# Altium schematic sheet Power.SchDoc
size A4
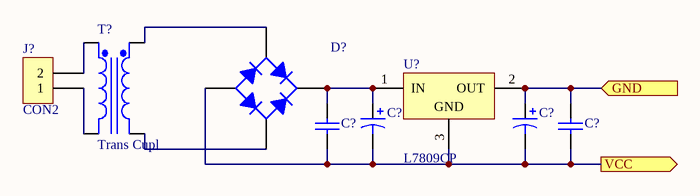
[diagram p0: Power.SchDoc]

## Parts
(Parts that share a designator on the sheet are numbered #1, #2 ... from top to bottom, then left to right.)
C?#1  Cap Pol2  [POLAR0.8]  (value not drawn)
C?#2  Cap Pol2  [POLAR0.8]  (value not drawn)
C?#3  Cap  [RAD-0.3]  (value not drawn)
C?#4  Cap  [RAD-0.3]  (value not drawn)
D?  Bridge1  [D-38]  (value not drawn)
J?  CON2  [PART]
T?  Trans Cupl  [TRF_4]
U?  L7809CP  [ISOWATT220AB]

## Ports
GND, VCC

## Nets
GND: C?#2.1 C?#4.2 U?.2(OUT) ; port GND
VCC: C?#1.2 C?#2.2 C?#3.1 C?#4.1 D?.1(A) U?.3(GND) ; port VCC
NetC?#1_1: C?#1.1 C?#3.2 D?.3(K) U?.1(IN)
NetD?_2: D?.2(C) T?.3(Sec+)
NetD?_4: D?.4(C) T?.4(Sec-)
NetJ?_1: J?.1 T?.2(Pri-)
NetJ?_2: J?.2 T?.1(Pri+)

## Library data of the parts
C?#1 C?#2 = Cap Pol2: Polarized Capacitor (Axial); Value: 100pF; Published: 8-Jun-2000; LatestRevisionDate: 17-Jul-2002; LatestRevisionNote: Re-released for DXP Platform.; PackageReference: POLAR0.8; Publisher: Altium Limited
C?#3 C?#4 = Cap: Capacitor; Value: 100pF; Published: 8-Jun-2000; LatestRevisionDate: 17-Jul-2002; LatestRevisionNote: Re-released for DXP Platform.; PackageReference: RAD-0.3; Publisher: Altium Limited
D? = Bridge1: Full Wave Diode Bridge; Published: 8-Jun-2000; LatestRevisionDate: 17-Jul-2002; LatestRevisionNote: Re-released for DXP Platform.; PackageReference: D-38; Publisher: Altium Limited
J? = CON2: Connector
T? = Trans Cupl: Transformer (Coupled Inductor Model); Published: 8-Jun-2000; LatestRevisionDate: 17-Jul-2002; LatestRevisionNote: Re-released for DXP Platform.; PackageReference: TRF_4; Publisher: Altium Limited
U? = L7809CP: Positive Voltage Regulator; Note: Tab is connected to pin 3 (GND).; Published: 24-Aug-2001; LatestRevisionDate: 17-Jul-2002; LatestRevisionNote: Re-released for DXP Platform.; DatasheetVersion: Dec-1998; PackageVersion: Jul-1998; PackageReference: ISOWATT220AB; Publisher: Altium Limited; PackageDescription: TO, Thru-Hole, Vertical, Heatsink Mounted; 3 In-Line Leads; Pitch 2.54 mm; Pin sequence 1, 3, 2; ComponentLink1Description: Manufacturer Link; ComponentLink1URL: http://www.st.com/